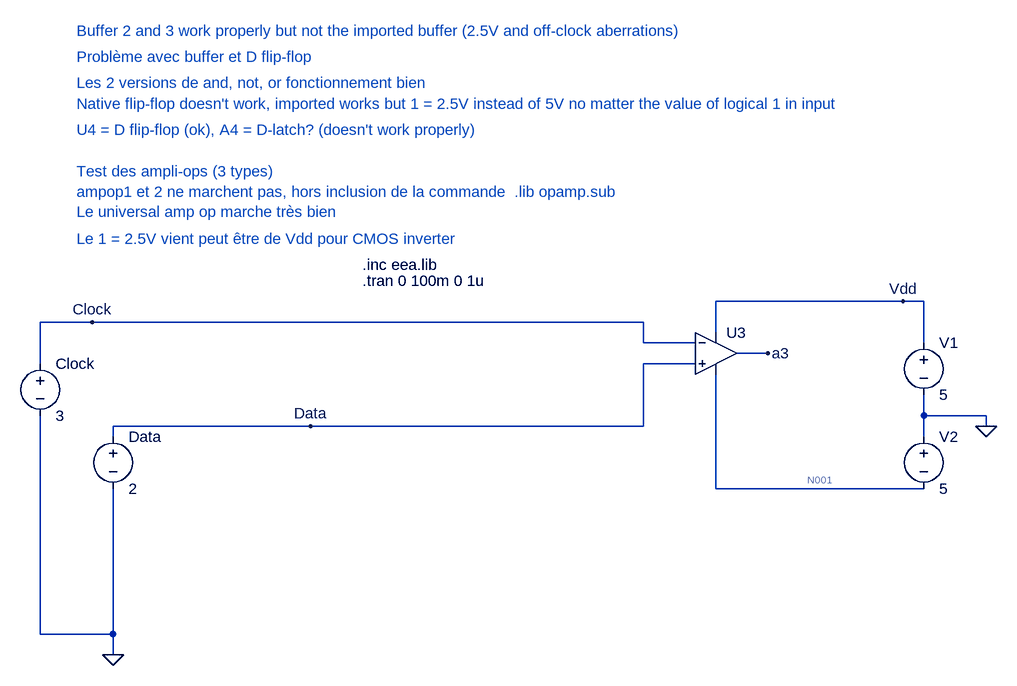
[diagram p0: schematic Tests.asc]
Tests.asc, the LTspice schematic file:
Version 4
SHEET 1 1044 680
WIRE 896 -32 608 -32
WIRE 928 -32 896 -32
WIRE -352 0 -432 0
WIRE 496 0 -352 0
WIRE 608 16 608 -32
WIRE 496 32 496 0
WIRE 576 32 496 32
WIRE 928 32 928 -32
WIRE 688 48 640 48
WIRE -432 64 -432 0
WIRE 576 64 496 64
WIRE 928 144 928 112
WIRE 1024 144 928 144
WIRE -16 160 -320 160
WIRE 496 160 496 64
WIRE 496 160 -16 160
WIRE 1024 160 1024 144
WIRE -320 176 -320 160
WIRE 928 176 928 144
WIRE 608 256 608 80
WIRE 928 256 608 256
WIRE -432 480 -432 144
WIRE -320 480 -320 256
WIRE -320 480 -432 480
WIRE -320 512 -320 480
FLAG -320 512 0
FLAG -352 0 Clock
FLAG -16 160 Data
FLAG 896 -32 Vdd
FLAG 688 48 a3
FLAG 1024 160 0
SYMBOL voltage -432 48 R0
WINDOW 123 0 0 Left 0
WINDOW 39 0 0 Left 0
SYMATTR InstName Clock
SYMATTR Value 3
SYMBOL voltage -320 160 R0
WINDOW 123 0 0 Left 0
WINDOW 39 0 0 Left 0
SYMATTR InstName Data
SYMATTR Value 2
SYMBOL OpAmps\\UniversalOpamp2 608 48 R0
SYMATTR InstName U3
SYMBOL voltage 928 16 R0
WINDOW 123 0 0 Left 0
WINDOW 39 0 0 Left 0
SYMATTR InstName V1
SYMATTR Value 5
SYMBOL voltage 928 160 R0
WINDOW 123 0 0 Left 0
WINDOW 39 0 0 Left 0
SYMATTR InstName V2
SYMATTR Value 5
TEXT 64 -88 Left 2 !.inc eea.lib
TEXT 64 -64 Left 2 !.tran 0 100m 0 1u
TEXT -376 -368 Left 2 ;Les 2 versions de and, not, or fonctionnement bien
TEXT -376 -408 Left 2 ;Problème avec buffer et D flip-flop
TEXT -376 -232 Left 2 ;Test des ampli-ops (3 types)\nampop1 et 2 ne marchent pas, hors inclusion de la commande  .lib opamp.sub\nLe universal amp op marche très bien
TEXT -376 -296 Left 2 ;U4 = D flip-flop (ok), A4 = D-latch? (doesn't work properly)
TEXT -376 -336 Left 2 ;Native flip-flop doesn't work, imported works but 1 = 2.5V instead of 5V no matter the value of logical 1 in input
TEXT -376 -448 Left 2 ;Buffer 2 and 3 work properly but not the imported buffer (2.5V and off-clock aberrations)
TEXT -376 -128 Left 2 ;Le 1 = 2.5V vient peut être de Vdd pour CMOS inverter

The netlist it stands for:
* Tests.asc
V§Clock Clock 0 3
V§Data Data 0 2
XU3 Data Clock Vdd N001 a3 level.2 Avol=1Meg GBW=10Meg Slew=10Meg ilimit=25m rail=0 Vos=0 phimargin=45 en=0 enk=0 in=0 ink=0 Rin=500Meg  ; pins IN+ IN- V+ V- OUT
V1 Vdd 0 5
V2 0 N001 5
.inc eea.lib
.tran 0 100m 0 1u
* Les 2 versions de and, not, or fonctionnement bien
* Problème avec buffer et D flip-flop
* Test des ampli-ops (3 types)
* ampop1 et 2 ne marchent pas, hors inclusion de la commande  .lib opamp.sub
* Le universal amp op marche très bien
* U4 = D flip-flop (ok), A4 = D-latch? (doesn't work properly)
* Native flip-flop doesn't work, imported works but 1 = 2.5V instead of 5V no matter the value of logical 1 in input
* Buffer 2 and 3 work properly but not the imported buffer (2.5V and off-clock aberrations)
* Le 1 = 2.5V vient peut être de Vdd pour CMOS inverter
.lib UniversalOpamps2.sub
.backanno
.end

* Results of the author's LTspice run, read from the files saved beside the schematic
* Operating Point, zero values left out:
*   V(clock) = 3 V
*   V(data) = 2 V
*   V(a3) = -5 V
*   V(vdd) = 5 V
*   V(n001) = -5 V
*   I(V2) = -1.082 µA
*   I(V1) = -1.172 µA
*   I(Data) = -4 nA
*   I(Clock) = -6 nA
*   Ix(u3:1) = 4 nA
*   Ix(u3:2) = 6 nA
*   Ix(u3:3) = 1.172 µA
*   Ix(u3:4) = -1.082 µA